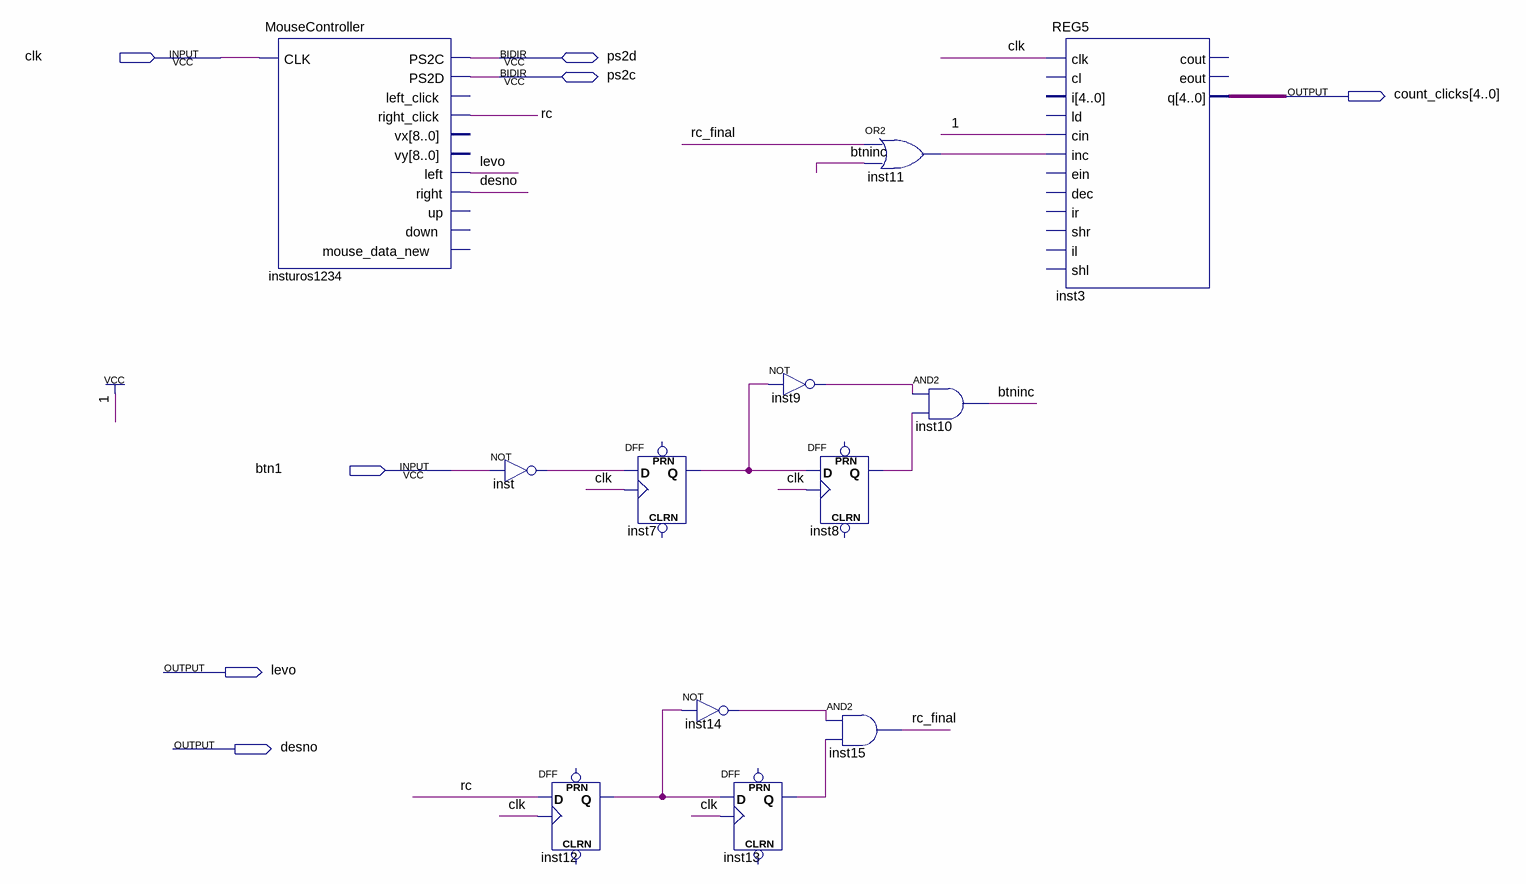
[diagram p0: schematic sheet]
// Quartus schematic main.bdf as structural Verilog: 12 symbols, 7 pins
module main (
  input  clk,
  input  btn1,
  inout  ps2d,
  inout  ps2c,
  output [4:0] count_clicks,
  output levo,
  output desno
);

  wire btninc, inst7_q, inst8_q, inst9_out, inst11_out, inst12_q, inst13_q, inst14_out, inst_out, rc,
       rc_final;

  MouseController insturos1234 (
    .CLK(clk), .right_click(rc), .left(levo), .right(desno), .PS2C(ps2d), .PS2D(ps2c));  // open: left_click, vx, vy, up, down, mouse_data_new
  not inst (inst_out, btn1);
  DFF inst12 (.CLK(clk), .D(rc), .Q(inst12_q));  // open: CLRN, PRN
  DFF inst7 (.CLK(clk), .D(inst_out), .Q(inst7_q));  // open: CLRN, PRN
  not inst14 (inst14_out, inst12_q);
  DFF inst13 (.CLK(clk), .D(inst12_q), .Q(inst13_q));  // open: CLRN, PRN
  not inst9 (inst9_out, inst7_q);
  DFF inst8 (.CLK(clk), .D(inst7_q), .Q(inst8_q));  // open: CLRN, PRN
  or inst11 (inst11_out, rc_final, btninc);
  and inst15 (rc_final, inst14_out, inst13_q);
  and inst10 (btninc, inst9_out, inst8_q);
  REG5 inst3 (
    .clk(clk), .cin(1'b1), .inc(inst11_out), .q(count_clicks));  // open: cl, i, ld, ein, dec, ir, shr, il, shl, cout, eout
endmodule
